# Altium schematic sheet PowerBoard.SchDoc
size A4
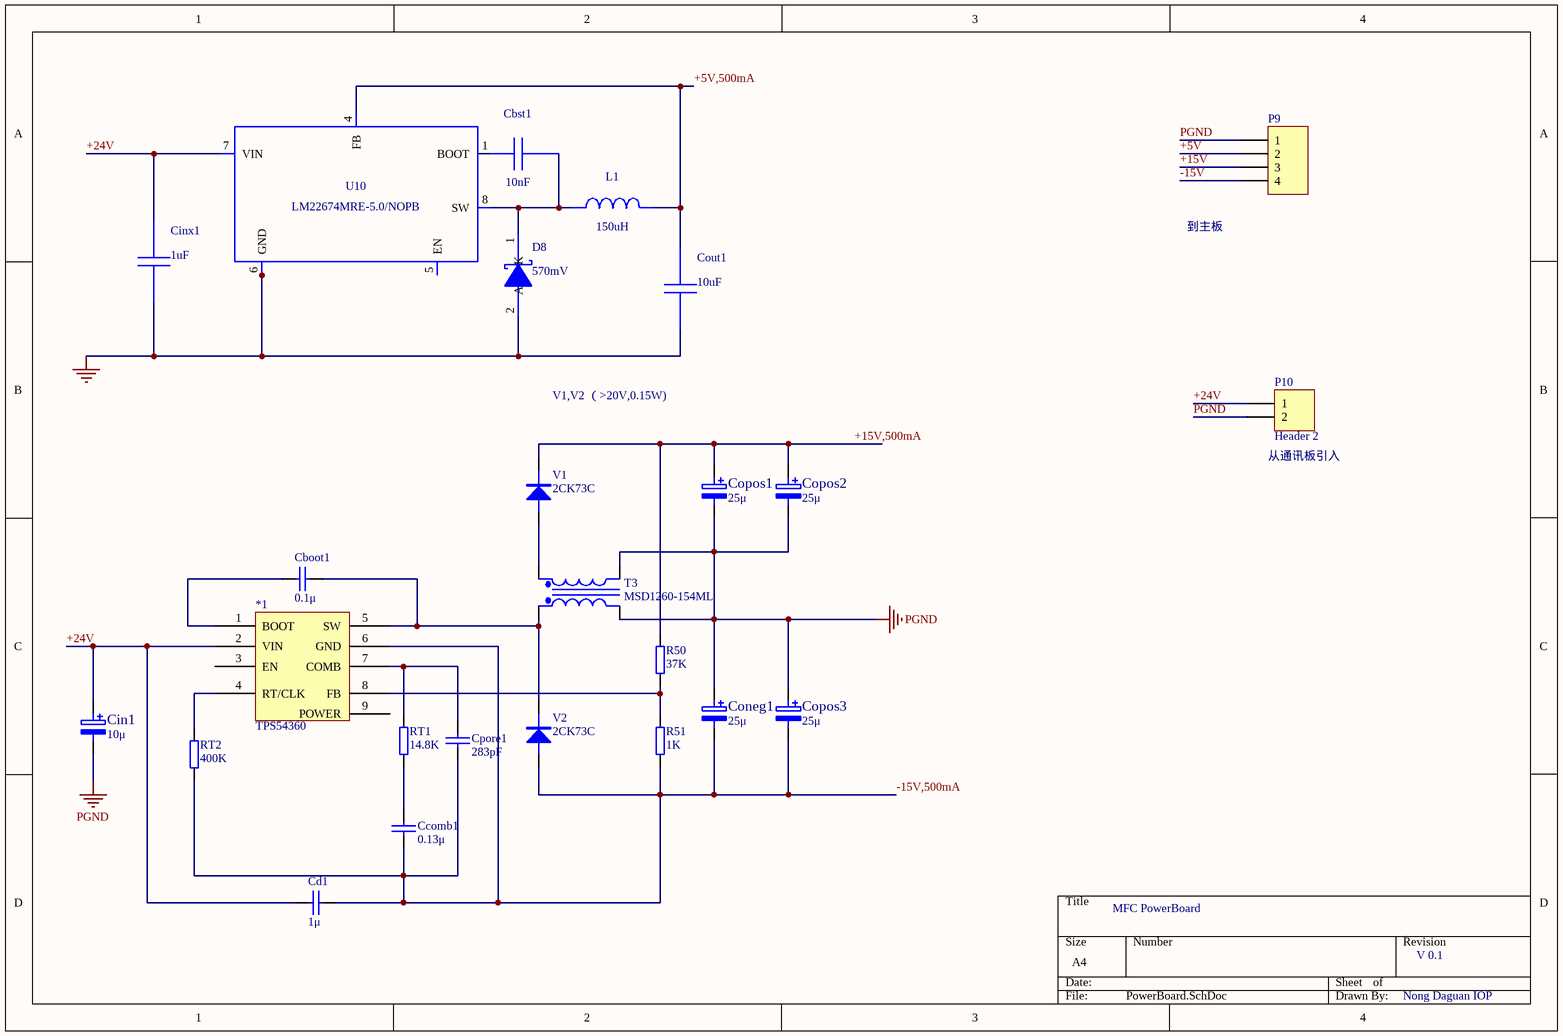
[diagram p0: PowerBoard.SchDoc]

## Parts
*1  TPS54360
Cboot1  0.1μ  [C.1]
Cbst1  value 10nF  (hidden comment: C0805C103K5RACTU)
Ccomb1  0.13μ  [C.1]
Cd1  1μ  [C.1]
Cin1  10μ  [CA-22U]
Cinx1  value 1uF  (hidden comment: C1608X5R1H105K080AB)
Coneg1  25μ  [CA-22U]
Copos1  25μ  [CA-22U]
Copos2  25μ  [CA-22U]
Copos3  25μ  [CA-22U]
Cout1  value 10uF  (hidden comment: C0805C106K8PACTU)
Cpore1  283pF  [C.1]
D8  value 570mV  (hidden comment: PMEG6010CEH,115)
L1  value 150uH  (hidden comment: VLP8040T-151M)
P9  (no value)  [HDR1X4]
P10  Header 2  [HDR1X2]
R50  37K  [R.4]
R51  1K  [R.4]
RT1  14.8K  [R.4]
RT2  400K  [R.4]
T3  MSD1260-154ML  [TRF_4]
U10  LM22674MRE-5.0/NOPB
V1  2CK73C  [V.4]
V2  2CK73C  [V.4]

## Nets
PGND: Cin1.2 Cinx1.2 Coneg1.1 Copos1.2 Copos2.2 Copos3.1 Cout1.2 D8.2(A) P9.1 P10.2 T3.2(Pri-) T3.4(Sec-) U10.2(NC) U10.3(NC) U10.6(GND) U10.9(DAP)
+5V: P9.2
+5V,500mA: Cout1.1 L1.2 U10.4(FB)
+15V: P9.3
+15V,500mA: Copos1.1 Copos2.1 R50.2 V1.K
+24V: *1.2(VIN) Cd1.1 Cin1.1 Cinx1.1 P10.1 U10.7(VIN)
-15V: P9.4
-15V,500mA: *1.6(GND) Ccomb1.2 Cd1.2 Coneg1.2 Copos3.2 Cpore1.2 R51.1 RT2.2 V2.A
Net*1_1: *1.1(BOOT) Cboot1.1
Net*1_4: *1.4(RT/CLK) RT2.1
Net*1_5: *1.5(SW) Cboot1.2 T3.1(Pri+) V2.K
Net*1_7: *1.7(COMB) Cpore1.1 RT1.1
Net*1_8: *1.8(FB) R50.1 R51.2
NetCbst1_1: Cbst1.1 D8.1(K) L1.1 U10.8(SW)
NetCbst1_2: Cbst1.2 U10.1(BOOT)
NetCcomb1_1: Ccomb1.1 RT1.2
NetT3_3: T3.3(Sec+) V1.A

Not connected (* = marked no-connect by the designer): *1 3(EN) 9(POWER); U10 5(EN)

## Notes on the sheet
- 到主板
- V1,V2 （>20V,0.15W)
- (near P10) 从通讯板引入
- MFC PowerBoard
- V 0.1
- Nong Daguan IOP

## Library data of the parts
Cboot1 Ccomb1 Cd1 Cpore1 = CAP
Cbst1 = C0805C103K5RACTU: Manufacturer Name: Kemet; PackageReference: C0805C103K5RACTU; Manufacturer Part Number: C0805C103K5RACTU
Cin1 Coneg1 Copos1-Copos3 = ELECTRO2
Cinx1 = C1608X5R1H105K080AB: C1608X5R1H105K08; Manufacturer Name: TDK; PackageReference: C1608X5R1H105K080AB; Manufacturer Part Number: C1608X5R1H105K080AB
Cout1 = C0805C106K8PACTU: Manufacturer Name: Kemet; PackageReference: C0805C106K8PACTU; Manufacturer Part Number: C0805C106K8PACTU
D8 = PMEG6010CEH,115: Manufacturer Name: Nexperia; PackageReference: PMEG6010CEH,115; Manufacturer Part Number: PMEG6010CEH,115
L1 = VLP8040T-151M: Unknown; Manufacturer Name: TDK; PackageReference: VLP8040T-151M; Manufacturer Part Number: VLP8040T-151M
P9 = Header 4: Header, 4-Pin; LatestRevisionDate: 17-Jul-2002; LatestRevisionNote: Re-released for DXP Platform.; Publisher: Altium Limited
P10 = Header 2: Header, 2-Pin; LatestRevisionDate: 17-Jul-2002; LatestRevisionNote: Re-released for DXP Platform.; Publisher: Altium Limited
R50 R51 RT1 RT2 = RES_1
T3 = Trans Cupl: Transformer (Coupled Inductor Model); Published: 8-Jun-2000; LatestRevisionDate: 17-Jul-2002; LatestRevisionNote: Re-released for DXP Platform.; PackageReference: TRF_4; Publisher: Altium Limited; PackageDescription: Transformer; 4 Leads
U10 = LM22674MRE-5.0/NOPB: LM22674MRE-5.0/N; Manufacturer Name: Texas Instruments; PackageReference: LM22674MRE-5.0/NOPB; Manufacturer Part Number: LM22674MRE-5.0/NOPB; Value: Value
V1 V2 = DIODE